# Altium schematic sheet Sheet3.SchDoc
size A4; SheetNumber: 3; SheetTotal: 3
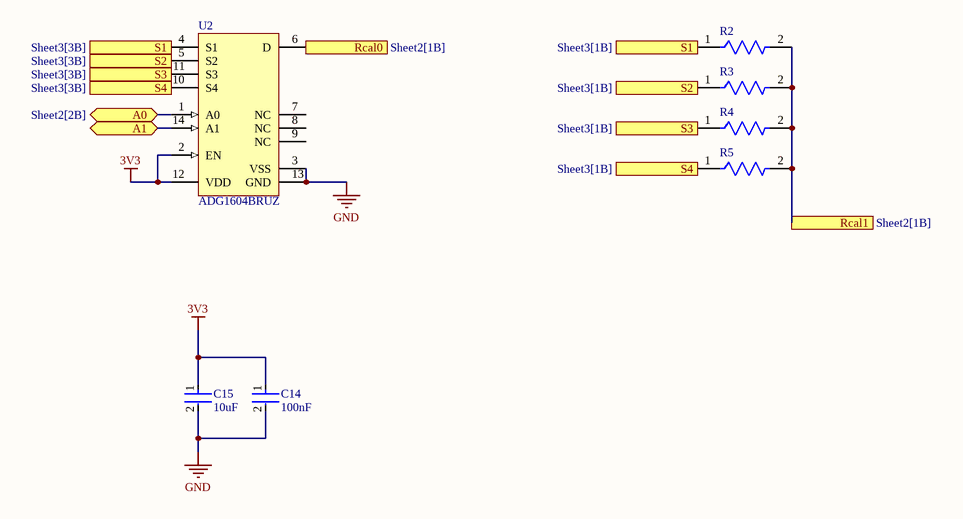
[diagram p0: Sheet3.SchDoc]

## Parts
C14  100nF  [FP-GRM18-0_15-MFG]
C15  10uF  [FP-GRM18-0_15-MFG]
R2  RT0603BRB07200RL  [FP-RT0603-MFG]  (value not drawn)
R3  AC0603FR-132KL  [FP-AC0603-MFG]  (value not drawn)
R4  RT0603BRB07200RL  [FP-RT0603-MFG]  (value not drawn)
R5  AC0603FR-132KL  [FP-AC0603-MFG]  (value not drawn)
U2  ADG1604BRUZ  [ADI-RU-14_N]

## Ports
A0 (bidir, see Sheet2[2B]), A1 (bidir, see Sheet2[2B]), Rcal0 (see Sheet2[1B]), Rcal1 (see Sheet2[1B]), S1 (see Sheet3[1B]), S1 (see Sheet3[3B]), S2 (see Sheet3[1B]), S2 (see Sheet3[3B]), S3 (see Sheet3[1B]), S3 (see Sheet3[3B]), S4 (see Sheet3[1B]), S4 (see Sheet3[3B])

## Nets
3V3: C14.1 C15.1 U2.2(EN) U2.12(VDD)
GND: C14.2 C15.2 U2.3(VSS) U2.13(GND)
A0: U2.1(A0) ; port A0
A1: U2.14(A1) ; port A1
Rcal0: U2.6(D) ; port Rcal0
Rcal1: R2.2 R3.2 R4.2 R5.2 ; port Rcal1
S1: R2.1 U2.4(S1) ; port S1
S2: R3.1 U2.5(S2) ; port S2
S3: R4.1 U2.11(S3) ; port S3
S4: R5.1 U2.10(S4) ; port S4

Not connected (* = marked no-connect by the designer): U2 7(NC) 8(NC) 9(NC)

## Library data of the parts
C14 = CMP-2000-05448-2: CAP CER 10UF 10V X5R 0603; Manufacturer Part Number: GRM188R61A106KE69D; Manufacturer: Murata; Temperature Coefficient: 15%; Material: Ceramic; Tolerance: 10%; Device Class L1: Passive Components; ComponentLink2Description: Datasheet; Height: 0.95mm; Package: GRM18-0.15; Octopart: https://octopart.com/grm188r61a106ke69d-murata-22851381; Value: 10uF; Digikey Description: CAP CER 10UF 10V X5R 0603; Temperature Range High: +85°C; Temperature Range Low: -55°C; Temperature Characteristic: X5R; Capacitance: 10uF; RoHS: TRUE; Device Class L2: Capacitors; ComponentLink2URL: https://search.murata.co.jp/Ceramy/image/img/A01X/G101/ENG/GRM188R61A106KE69-01A.pdf; Device Class L3: Ceramic Capacitors; Lead Free: Yes; Mouser Description: Multilayer Ceramic Capacitors MLCC - SMD/SMT 0603 10uF 10volts X5R + - 10%; Category: Cap; Voltage Rating: 10V; Temperature: -55°C to +85°C; Automotive: No
C15 = CMP-2000-05448-2: Manufacturer Part Number: GRM188R61A106KE69D; Manufacturer: Murata; Temperature Coefficient: 15%; Temperature Characteristic: X5R; Material: Ceramic; Tolerance: 10%; Voltage Rating: 10V; Device Class L1: Passive Components; ComponentLink2Description: Datasheet; Height: 0.95mm; Package: GRM18-0.15; Octopart: https://octopart.com/grm188r61a106ke69d-murata-22851381; Value: 10uF; Digikey Description: CAP CER 10UF 10V X5R 0603; Temperature Range High: +85°C; Temperature Range Low: -55°C; Capacitance: 10uF; RoHS: TRUE; Device Class L2: Capacitors; ComponentLink2URL: https://search.murata.co.jp/Ceramy/image/img/A01X/G101/ENG/GRM188R61A106KE69-01A.pdf; Device Class L3: Ceramic Capacitors; Lead Free: Yes; Mouser Description: Multilayer Ceramic Capacitors MLCC - SMD/SMT 0603 10uF 10volts X5R + - 10%; Category: Cap; Temperature: -55°C to +85°C; Automotive: No
R2 R4 = CMP-03412-026497-1: RES SMD 200 OHM 0.1% 1/10W 0603; Manufacturer: Yageo; Temperature Coefficient: 10 ppm/°C; Value: 200Ω; Power Rating: 0.1W; Voltage Rating: 75V; Tolerance: 0.001; Category: Res; Octopart: https://octopart.com/rt0603brb07200rl-yageo-71393466; Series: RT; Device Class L3: Chip SMD Resistors; Device Class L1: Passive Components; Temperature: -55°C to +155°C; Device Class L2: Resistors; Temperature Range Low: -55°C; Footprint Url: http://www.yageo.com/exep/pages/download/literatures/PYu-R_Mount_10.pdf; Automotive: No; Height: 0.55mm; RoHS: TRUE; Manufacturer Part Number: RT0603BRB07200RL; Ipc Land Pattern Name: RESC16080X45; Resistance: 200Ω; Package: RT0603; Lead Free: Yes; Composition: Thin Film; Mouser Description: Thin Film Resistors - SMD 1/10W 200 ohm .1% 10ppm; Temperature Range High: +155°C; ComponentLink2URL: http://www.yageo.com/documents/recent/PYu-RT_1-to-0.01_RoHS_L_9.pdf; ComponentLink2Description: Datasheet; Digikey Description: RES SMD 200 OHM 0.1% 1/10W 0603
R3 R5 = CMP-03412-038998-1: RES 2kΩ 1.00% 0.1W 0603; RoHS Compliant: Yes
U2 = CMP-0793-00105-1: 1 Ohm Typical On Resistance, +/-5 V, +12 V, +5 V and +3.3 V, 4:1 Multiplexer, 0.95 Ohm Ron, 14-pin SOP (RU-14), Tube; Manufacturer: Analog Devices; Bandwidth (Hz): 15M, 19M, 16M, 15M; Ron (ohms): 950m; t transition (s): 100n; Max Analog Signal Range: Vss to Vdd; DatasheetVersion: Rev. A; Code_JEDEC: MO-153AB-1; Mounting Technology: Surface Mount; PartNumber: ADG1604BRUZ; ComponentLink2URL: http://www.analog.com/static/imported-files/data_sheets/ADG1604.pdf; ComponentLink3Description: Package Specification; PackageReference: RU-14; PackageVersion: Aug-02; ComponentLink2Description: Datasheet; Packing: Tube; PackageDescription: 14-Pin Thin Shrink Small Outline Package, Body 5 x 4.4 mm, Pitch 0.65 mm; ComponentLink1Description: Manufacturer URL; ComponentLink1URL: http://www.analog.com/en/index.html; ComponentLink3URL: http://www.analog.com/static/imported-files/packages/36057385283879153717235186773RU14.pdf